# Altium schematic sheet calculations.SchDoc
size A4
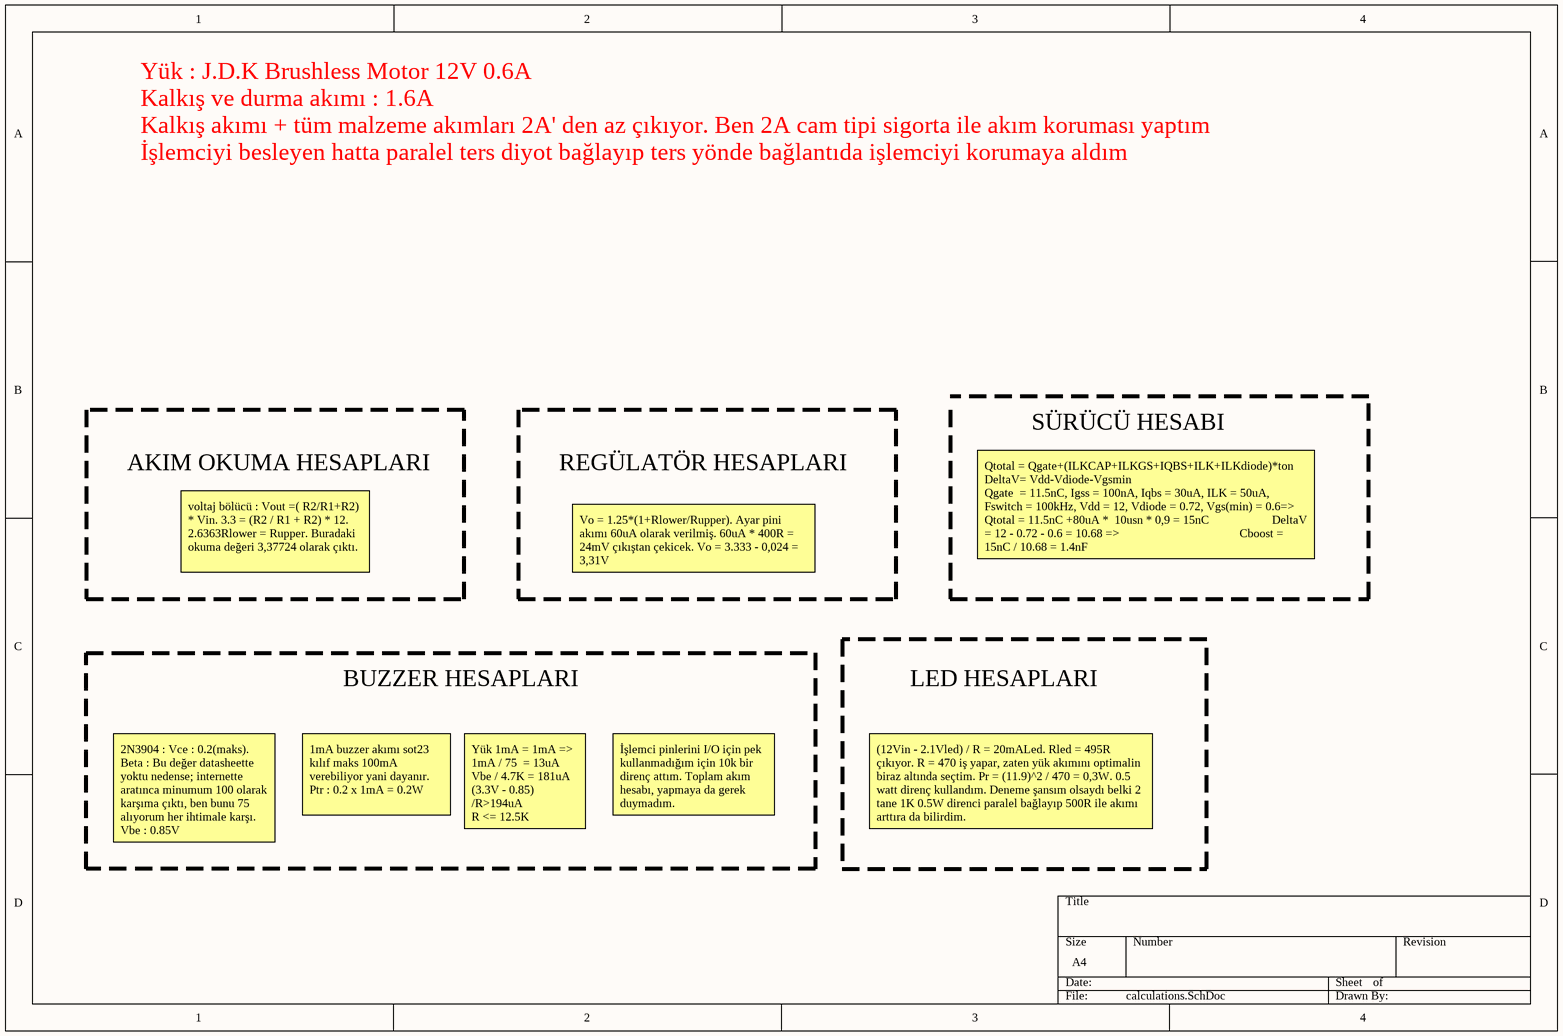
[diagram p0: calculations.SchDoc]

## Notes on the sheet
- Yük : J.D.K Brushless Motor 12V 0.6A
- Kalkış ve durma akımı : 1.6A
- Kalkış akımı + tüm malzeme akımları 2A' den az çıkıyor. Ben 2A cam tipi sigorta ile akım koruması yaptım
- İşlemciyi besleyen hatta paralel ters diyot bağlayıp ters yönde bağlantıda işlemciyi korumaya aldım
- SÜRÜCÜ HESABI
- AKIM OKUMA HESAPLARI
- REGÜLATÖR HESAPLARI
- voltaj bölücü : Vout =( R2/R1+R2) * Vin. 3.3 = (R2 / R1 + R2) * 12. 2.6363Rlower = Rupper. Buradaki okuma değeri 3,37724 olarak çıktı.
- Vo = 1.25*(1+Rlower/Rupper). Ayar pini akımı 60uA olarak verilmiş. 60uA * 400R =  24mV çıkıştan çekicek. Vo = 3.333 - 0,024 = 3,31V
- Qtotal = Qgate+(ILKCAP+ILKGS+IQBS+ILK+ILKdiode)*ton DeltaV= Vdd-Vdiode-Vgsmin
  Qgate  = 11.5nC, Igss = 100nA, Iqbs = 30uA, ILK = 50uA, Fswitch = 100kHz, Vdd = 12, Vdiode = 0.72, Vgs(min) = 0.6=> Qtotal = 11.5nC +80uA *  10usn * 0,9 = 15nC                     DeltaV = 12 - 0.72 - 0.6 = 10.68 =>                                        Cboost = 15nC / 10.68 = 1.4nF
- BUZZER HESAPLARI
- LED HESAPLARI
- 2N3904 : Vce : 0.2(maks). Beta : Bu değer datasheette yoktu nedense; internette aratınca minumum 100 olarak karşıma çıktı, ben bunu 75 alıyorum her ihtimale karşı. Vbe : 0.85V
- 1mA buzzer akımı sot23 kılıf maks 100mA verebiliyor yani dayanır. Ptr : 0.2 x 1mA = 0.2W
- Yük 1mA = 1mA => 1mA / 75  = 13uA Vbe / 4.7K = 181uA (3.3V - 0.85) /R>194uA                      R <= 12.5K
- İşlemci pinlerini I/O için pek kullanmadığım için 10k bir direnç attım. Toplam akım hesabı, yapmaya da gerek duymadım.
- (12Vin - 2.1Vled) / R = 20mALed. Rled = 495R çıkıyor. R = 470 iş yapar, zaten yük akımını optimalin biraz altında seçtim. Pr = (11.9)^2 / 470 = 0,3W. 0.5 watt direnç kullandım. Deneme şansım olsaydı belki 2 tane 1K 0.5W direnci paralel bağlayıp 500R ile akımı arttıra da bilirdim.